# EAGLE design relay (EAGLE 7.1.0)
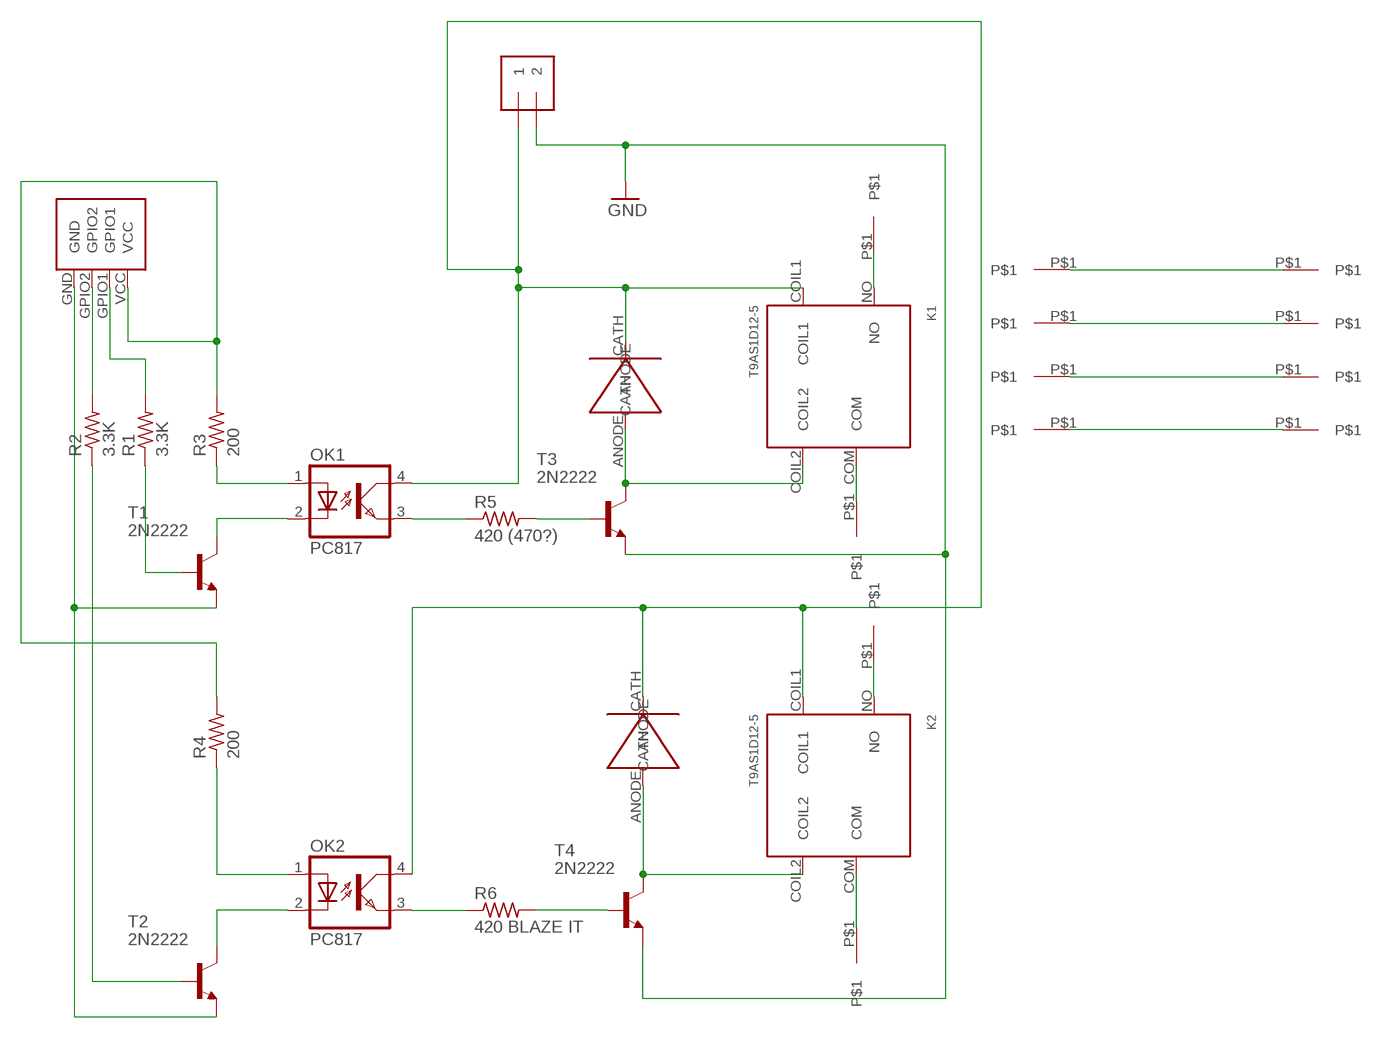
[diagram p0: schematic, sheet 1]

## Parts
J1  1X2-3.5MM  [1X2-3.5MM]
K1  T9AS1D12-5  [T9AS1D12-5]
K2  T9AS1D12-5  [T9AS1D12-5]
OK1  PC817  [DIL04]
OK2  PC817  [DIL04]
R1  3.3K  R-US_R0805  [R0805]
R2  3.3K  R-US_R0805  [R0805]
R3  200  R-US_R0805  [R0805]
R4  200  R-US_R0805  [R0805]
R5  420 (470?)  R-US_R0805  [R0805]
R6  420 BLAZE IT  R-US_R0805  [R0805]
T1  2N2222  [TO92-EBC-OVAL]
T2  2N2222  [TO92-EBC-OVAL]
T3  2N2222  [TO92-EBC-OVAL]
T4  2N2222  [TO92-EBC-OVAL]
U$1  MTA-156  [MTA-156_HEADER]
U$2  VTB8441BH  [VTB8441BH]
U$3  VTB8441BH  [VTB8441BH]
U$4  MAIN  [MAIN]
U$5  MAIN  [MAIN]
U$6  MAIN  [MAIN]
U$7  MAIN  [MAIN]
U$8  MAIN  [MAIN]
U$9  MAIN  [MAIN]
U$10  MAIN  [MAIN]
U$11  MAIN  [MAIN]
U$12  MAIN  [MAIN]
U$13  MAIN  [MAIN]
U$14  MAIN  [MAIN]
U$15  MAIN  [MAIN]

## Nets
GND: J1.2 T3.E T4.E
N$1: R2.2 U$1.GPIO2
N$2: R1.2 U$1.GPIO1
N$3: R1.1 T1.B
N$4: OK1.1(A) R3.1
N$5: OK1.2(C) T1.C
N$6: R3.2 R4.2 U$1.VCC
N$7: T1.E T2.E U$1.GND
N$8: R2.1 T2.B
N$10: OK2.1(A) R4.1
N$11: OK2.2(C) T2.C
N$12: OK2.3(EMIT) R6.1
N$13: OK1.3(EMIT) R5.1
N$14: R5.2 T3.B
N$15: R6.2 T4.B
N$16: K2.COIL2 T4.C U$3.ANODE
N$17 [MAIN]: U$12.P$1 U$13.P$1
N$18: K1.COIL2 T3.C U$2.ANODE
N$19 [MAIN]: U$14.P$1 U$15.P$1
N$30 [MAIN]: K1.NO U$4.P$1
N$31 [MAIN]: K1.COM U$5.P$1
N$32: J1.1 K1.COIL1 K2.COIL1 OK1.4(COL) OK2.4(COL) U$2.CATH U$3.CATH
N$33 [MAIN]: K2.NO U$6.P$1
N$34 [MAIN]: K2.COM U$7.P$1
N$35 [MAIN]: U$9.P$1 U$11.P$1
N$36 [MAIN]: U$8.P$1 U$10.P$1

## Library data of the parts
J1 = adafruit:1X2: 3.5mm Terminal block http://www.ladyada.net/library/pcb/eaglelibrary.html
K1 K2 = BloomWall:T9AS1D12-5: T9AS1D12-5 - Power Relay Technical Specifications: Coil Current: 200 mA Coil Voltage: 5VDC Switching Voltage: 277 VAC Contact Rating (Current): 30 A Coil Resistance: 25 Ohms Digikey: PB1014-ND
OK1 OK2 = optocoupler:PC817: SHARP OPTO COUPLER; MPN: PC817X4J000F; OC_FARNELL: 9707727; OC_NEWARK: 97K7059
R1-R6 = resistor:R-US_: RESISTOR, American symbol
T1-T4 = adafruit:2N2222: NPN TRANSISTOR Big oval pads
U$1 = BloomWall:MTA-156: TE CONNECTIVITY / AMP 640445-4 - 4-wire to board connector Newark Part No.: 90F4055 Connector: Manufacturer Part No.: 3-640429-4 Newark Part No.: 87K2225
U$2 U$3 = BloomWall:VTB8441BH
U$4-U$15 = BloomWall:MAIN

## Net classes
0 default: width 0.305 mm, drill 0.508 mm, clearance 0.254 mm
1 MAIN: width 5.715 mm, drill 5.715 mm, clearance 0.508 mm

## Board
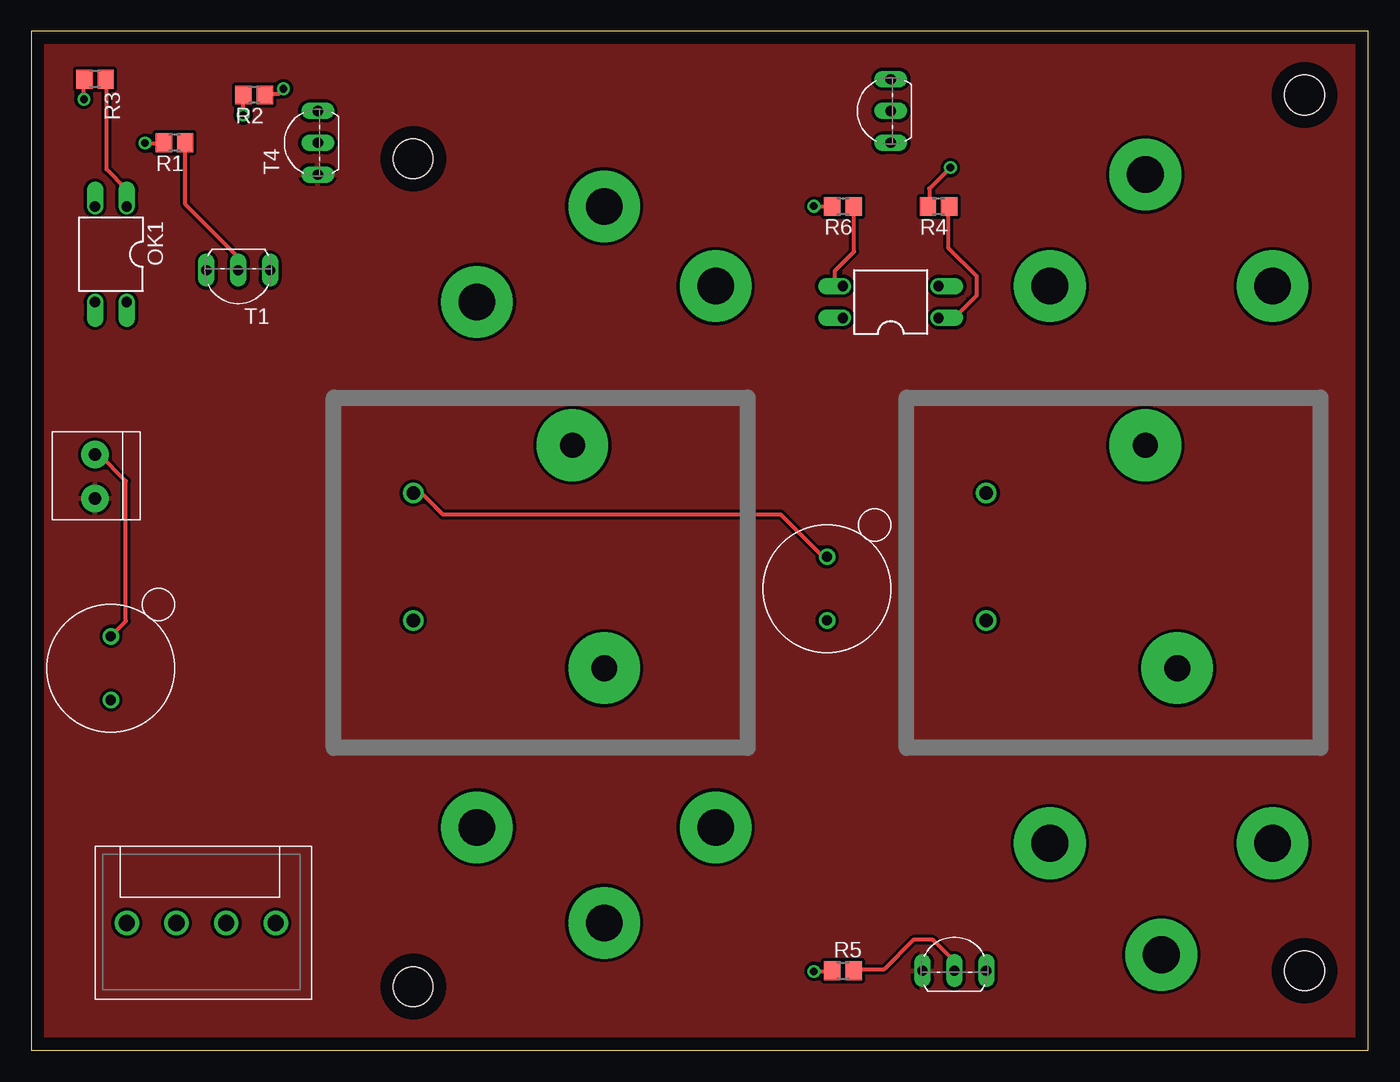
[diagram p1: board, top side]
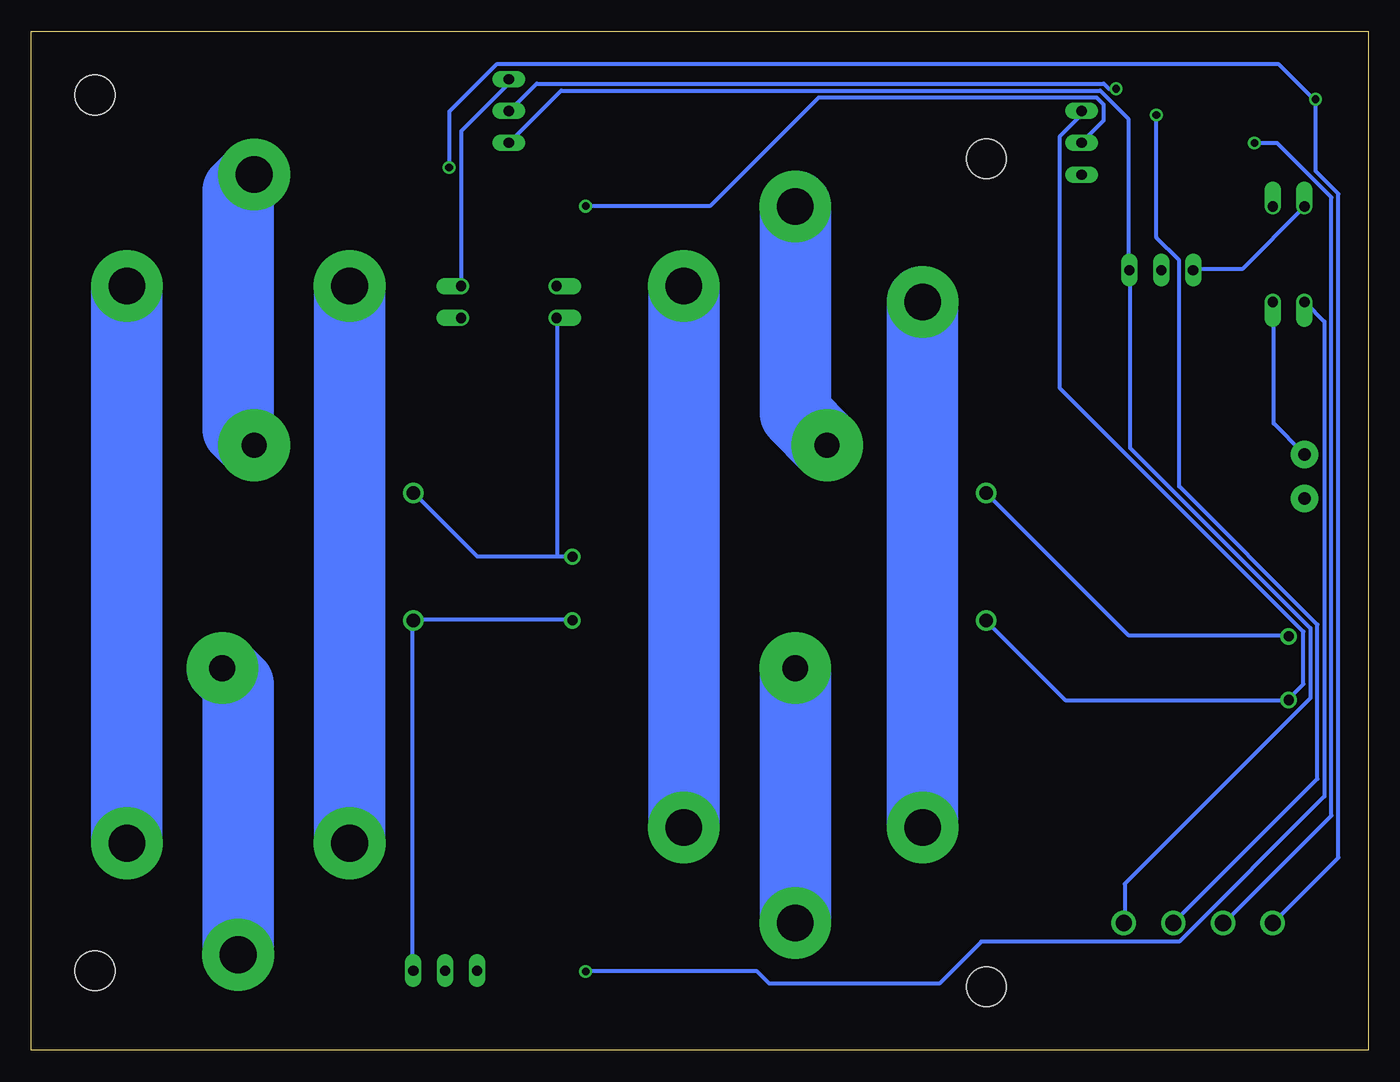
[diagram p2: board, bottom side, seen from below]

Size 106.68 x 81.28 mm. Coordinates in mm from the lower left corner, seen from the top.
Outline: 0,0 106.68,0 106.68,81.28 0,81.28 0,0
Copper layers (1*16): Top 0.035mm / dielectric 1.5mm / Bottom 0.035mm
Design rules "default": minimum track width 10mil, minimum drill 24mil, track to track 8mil, track to pad 8mil, pad to pad 8mil, via to via 8mil, smd to smd 8mil, copper to edge 40mil, drill to drill 8mil, minimum pad ring 10mil, minimum via ring 8mil, stop-mask expansion 4mil, vias tented up to drill 0mil, thermal gap 10mil
Holes 3.17 mm at 101.6,76.2 101.6,6.35 30.48,71.12 30.48,5.08

### Footprints (pad centres in the part's own frame; a part is rotated, then mirrored left to right if it is on the bottom)
1X2-3.5MM = drill 1 pad 2.184: 1 1.8,0; 2 -1.7,0
T9AS1D12-5 = drill 1.092: COIL1 -13.97,-22.86; COIL2 -3.81,-22.86 | drill 1.981 pad 5.715: COM -17.78,-10.16 | drill 2.057 pad 5.715: NO 0,-7.62
DIL04 = drill 0.813 offset: 1 -1.27,-3.81; 2 1.27,-3.81; 3 1.27,3.81; 4 -1.27,3.81
R0805 = smd 1.3 x 1.5: 1 -0.85,0; 2 0.85,0
TO92-EBC-OVAL = drill 0.813 long: B 0,-1.27; C 2.54,-1.27; E -2.54,-1.27
MTA-156_HEADER = drill 1.295: GND 11.887,0; GPIO1 3.962,0; GPIO2 7.925,0; VCC 0,0
VTB8441BH = drill 0.8: ANODE 2.54,0; CATH -2.54,0
MAIN = drill 2.921 pad 5.715: P$1 0,0

### Placement (x,y rotation side)
J1  5.08,45.72 90 top
K1  99.06,30.48 270 top
K2  53.34,30.48 270 top
OK1  6.35,63.5 180 top
OK2  68.58,59.69 90 top
R1  11.43,72.39 180 top
R2  17.78,76.2 180 top
R3  5.08,77.47 180 top
R4  72.39,67.31 180 top
R5  64.77,6.35 0 top
R6  64.77,67.31 180 top
T1  16.51,60.96 180 top
T2  67.31,74.93 90 top
T3  73.66,7.62 0 top
T4  21.59,72.39 90 top
U$1  7.62,10.16 0 top
U$2  63.5,36.83 270 top
U$3  6.35,30.48 270 top
U$4  90.17,7.62 0 top
U$5  88.9,69.85 0 top
U$6  45.72,10.16 0 top
U$7  45.72,67.31 0 top
U$8  81.28,16.51 0 top
U$9  99.06,60.96 90 top
U$10  81.28,60.96 0 top
U$11  99.06,16.51 0 top
U$12  54.61,60.96 0 top
U$13  54.61,17.78 0 top
U$14  35.56,59.69 0 top
U$15  35.56,17.78 0 top

### Tracks (layer width: path | path; a pad name or v marks a point on that pad's centre or on a via)
GND
  pour Top: -2.54,82.55 -2.54,-2.54 109.22,-2.54 109.22,82.55
N$1  (via drill 0.61)
  Top 0.305: v16.9,74.6 16.9,76.14 R2.2
  Bottom 0.305: v16.9,74.6 16.9,64.82 15.09,63.01 15.09,44.98 4.05,33.95 4.05,21.65 U$1.GPIO2
N$2  (via drill 0.61)
  Top 0.305: v9.08,72.36 10.48,72.36 R1.2
  Bottom 0.305: v9.08,72.36 7.26,72.36 2.93,68.03 2.93,18.72 11.46,10.2 U$1.GPIO1
N$3
  Top 0.305: R1.1 12.29,72.36 12.29,67.47 16.48,63.28 16.48,62.31 T1.B
N$4
  Top 0.305: R3.1 6.01,77.39 6.01,70.27 7.54,68.73 7.54,67.33 OK1.1
N$5
  Bottom 0.305: T1.C 13.97,62.31 10.06,62.31 5.17,67.2 OK1.2
N$6  (via drill 0.61)
  Top 0.305: v4.19,75.86 4.19,77.39 R3.2 | v73.34,70.41 71.67,68.73 71.67,67.33 R4.2
  Bottom 0.305: U$1.VCC 7.54,10.2 2.38,15.37 2.38,68.31 4.19,70.13 v4.19,75.86 4.33,75.86 7.12,78.65 69.57,78.65 73.34,74.88 v73.34,70.41
N$7
  Bottom 0.305: T2.E 68.45,72.5 64.4,76.56 21.37,76.56 19.14,74.32 19.14,62.31 T1.E 19,62.17 19,48.06 4.61,33.67 4.61,28.08 19.42,13.27 19.42,10.2 U$1.GND
N$8  (via drill 0.61)
  Top 0.305: v20.12,76.69 19.7,76.28 18.72,76.28 R2.1
  Bottom 0.305: v20.12,76.69 20.68,76.69 21.09,77.11 66.36,77.11 68.45,75.02 T2.B
N$10
  Top 0.305: R4.1 73.2,67.2 73.2,63.98 75.44,61.75 75.44,60.21 73.76,58.53 72.5,58.53 OK2.1
N$11
  Bottom 0.305: T2.C 68.59,77.39 68.59,77.11 72.36,73.34 72.36,61.05 OK2.2
N$12
  Top 0.305: R6.1 65.66,67.2 65.66,63.7 64.12,62.17 64.12,61.47 64.68,60.91 OK2.3
N$13  (via drill 0.61)
  Top 0.305: v62.45,6.29 63.84,6.29 R5.1
  Bottom 0.305: v62.45,6.29 48.76,6.29 47.78,5.31 34.23,5.31 30.87,8.66 15.09,8.66 3.49,20.26 3.49,58.12 5.03,59.65 OK1.3
N$14
  Top 0.305: R5.2 65.66,6.43 68.03,6.43 70.41,8.8 71.94,8.8 73.62,7.12 73.62,6.43 T3.B
N$15  (via drill 0.61)
  Top 0.305: v62.45,67.33 63.84,67.33 R6.2
  Bottom 0.305: v62.45,67.33 52.53,67.33 43.87,76 21.65,76 21.09,75.44 21.09,74.18 22.77,72.5 T4.B
N$16
  Bottom 0.305: K2.COIL2 30.45,34.23 24.17,27.94 U$3.ANODE 6.29,28.08 5.17,29.2 5.17,33.39 24.59,52.81 24.59,72.92 22.91,74.6 22.91,74.88 T4.C
N$17
  Bottom 5.715: U$12.P$1 U$13.P$1
N$18
  Bottom 0.305: U$2.ANODE 63.56,34.37 76.14,34.37 K1.COIL2 76.28,34.23 76.28,6.43 T3.C
N$19
  Bottom 5.715: U$14.P$1 U$15.P$1
N$30
  Bottom 5.715: K1.NO 90.17,29.21 U$4.P$1
N$31
  Bottom 5.715: U$5.P$1 90.17,68.58 90.17,49.53 K1.COM
N$32
  Top 0.305: J1.1 5.17,47.5 5.45,47.5 7.54,45.4 7.54,34.23 6.43,33.11 U$3.CATH | U$2.CATH 63.42,39.4 63.14,39.4 59.79,42.75 32.83,42.75 31.15,44.42 30.59,44.42 K2.COIL1
  Bottom 0.305: 64.68,39.4 71.11,39.4 76.14,44.42 K1.COIL1 | 64.68,39.4 63.56,39.4 U$2.CATH | 64.68,39.4 64.68,58.4 OK2.4 | OK1.4 7.54,59.65 7.54,50.01 5.17,47.64 J1.1 | K2.COIL1 19.14,33.11 6.43,33.11 U$3.CATH
N$33
  Bottom 5.715: K2.NO U$6.P$1
N$34
  Bottom 5.715: U$7.P$1 45.72,50.8 K2.COM
N$35
  Bottom 5.715: U$9.P$1 U$11.P$1
N$36
  Bottom 5.715: U$10.P$1 U$8.P$1